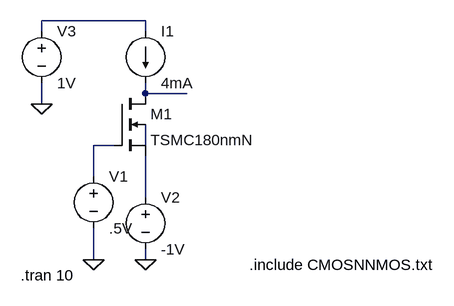
[diagram p0: schematic Problem4.asc]
Problem4.asc, the LTspice schematic file:
Version 4
SHEET 1 880 680
WIRE 160 -96 0 -96
WIRE 0 -80 0 -96
WIRE 160 -80 160 -96
WIRE 160 16 160 0
WIRE 224 16 160 16
WIRE 0 32 0 0
WIRE 112 96 80 96
WIRE 160 96 160 64
WIRE 80 144 80 96
WIRE 160 176 160 112
WIRE 80 272 80 224
WIRE 160 272 160 256
FLAG 160 272 0
FLAG 80 272 0
FLAG 0 32 0
SYMBOL voltage 80 128 R0
WINDOW 123 0 0 Left 0
WINDOW 39 0 0 Left 0
SYMATTR InstName V1
SYMATTR Value .5V
SYMBOL voltage 160 160 R0
WINDOW 123 0 0 Left 0
WINDOW 39 0 0 Left 0
SYMATTR InstName V2
SYMATTR Value -1V
SYMBOL voltage 0 -96 R0
WINDOW 123 0 0 Left 0
WINDOW 39 0 0 Left 0
SYMATTR InstName V3
SYMATTR Value 1V
SYMBOL current 160 -80 R0
WINDOW 123 0 0 Left 0
WINDOW 39 0 0 Left 0
SYMATTR InstName I1
SYMATTR Value 4mA
SYMBOL nmos4 112 16 R0
SYMATTR InstName M1
SYMATTR Value TSMC180nmN
SYMATTR Value2 l=0.18u w=5.58u
TEXT -32 296 Left 2 !.tran 10
TEXT 320 280 Left 2 !.include CMOSNNMOS.txt

The netlist it stands for:
* Problem4.asc
V1 N003 0 .5V
V2 N005 0 -1V
V3 N001 0 1V
I1 N001 N002 4mA
M1 N002 N003 N005 N004 TSMC180nmN l=0.18u w=5.58u
.model NMOS NMOS
.model PMOS PMOS
.lib standard.mos
.tran 10
.include CMOSNNMOS.txt
.backanno
.end